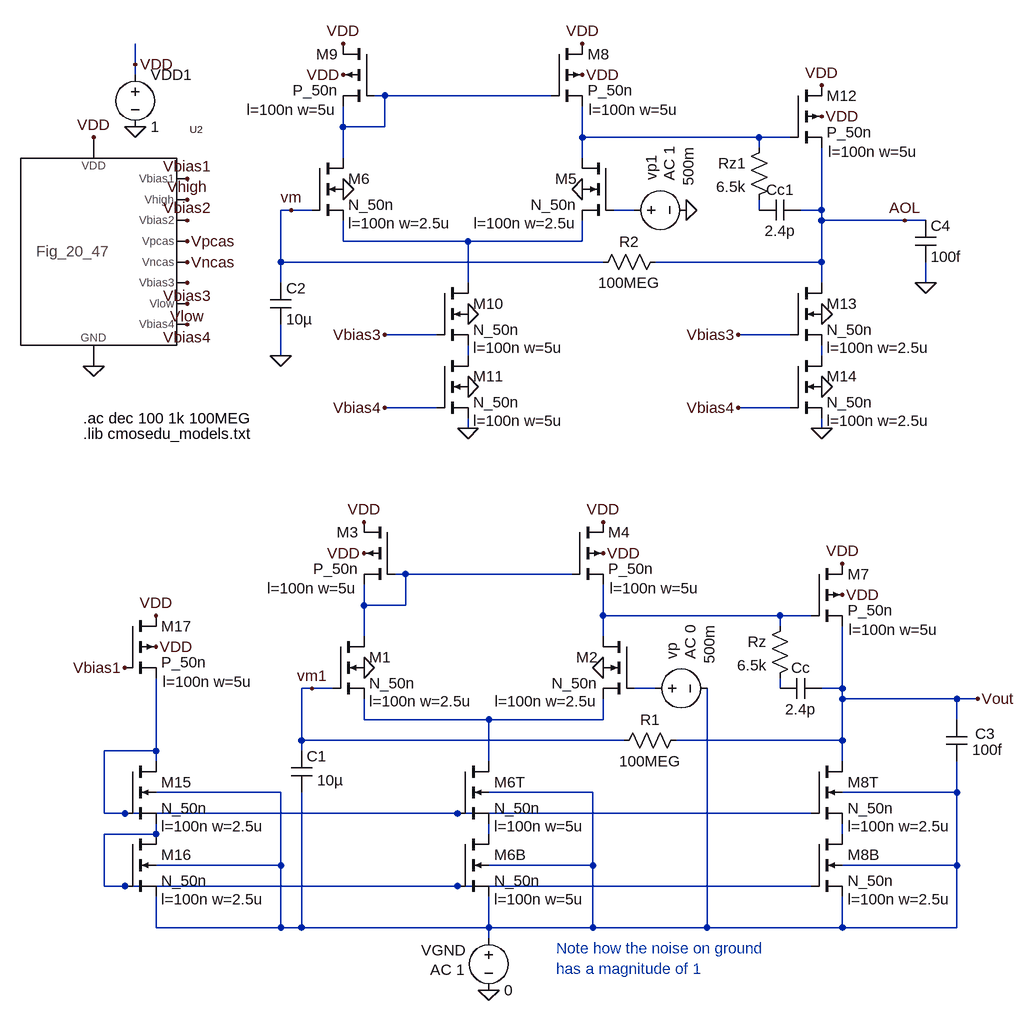
[diagram p0: schematic Fig24_27_PSRR_minus.asc]
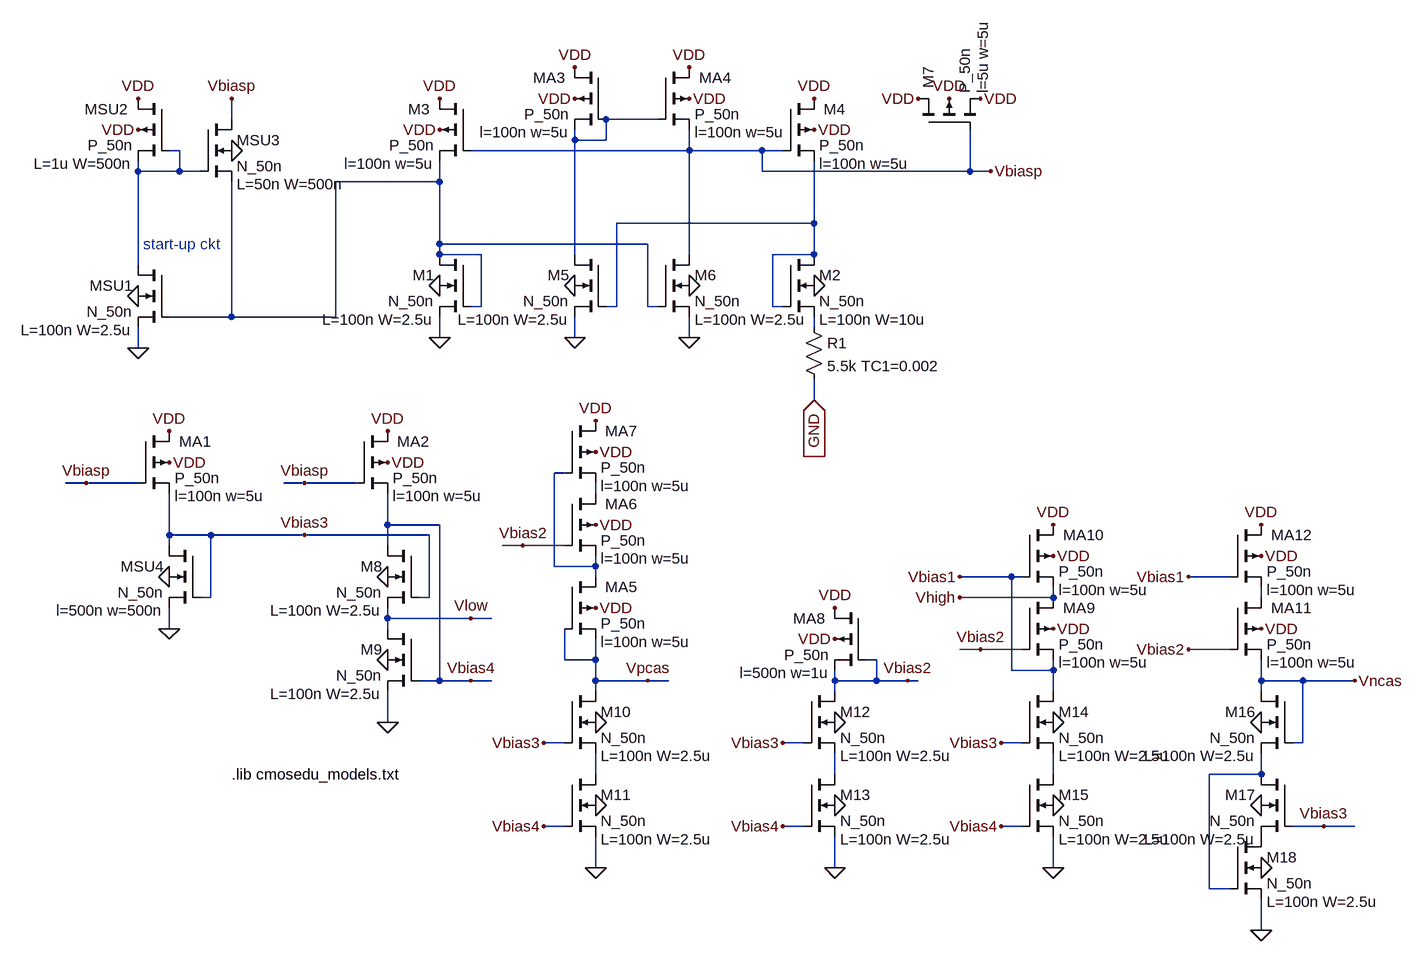
[diagram p1: sub-circuit fig_20_47.asc]
Fig24_27_PSRR_minus.asc, the LTspice schematic file:
Version 4
SHEET 1 2536 680
WIRE 848 -1536 848 -1568
WIRE 848 -1520 848 -1536
WIRE 1232 -1488 1216 -1488
WIRE 1488 -1488 1232 -1488
WIRE 1168 -1440 1168 -1472
WIRE 1232 -1440 1232 -1488
WIRE 1232 -1440 1168 -1440
WIRE 1536 -1424 1536 -1472
WIRE 1808 -1424 1536 -1424
WIRE 1856 -1424 1808 -1424
WIRE 1808 -1408 1808 -1424
WIRE 1168 -1392 1168 -1440
WIRE 1536 -1392 1536 -1424
WIRE 1088 -1312 1072 -1312
WIRE 1120 -1312 1088 -1312
WIRE 1616 -1312 1584 -1312
WIRE 1808 -1312 1808 -1328
WIRE 1904 -1312 1904 -1408
WIRE 1904 -1312 1872 -1312
WIRE 1904 -1296 1904 -1312
WIRE 2032 -1296 1904 -1296
WIRE 2064 -1296 2032 -1296
WIRE 1168 -1264 1168 -1296
WIRE 1360 -1264 1168 -1264
WIRE 1536 -1264 1536 -1296
WIRE 1536 -1264 1360 -1264
WIRE 1072 -1232 1072 -1312
WIRE 1568 -1232 1072 -1232
WIRE 1904 -1232 1904 -1296
WIRE 1904 -1232 1648 -1232
WIRE 1072 -1200 1072 -1232
WIRE 1360 -1200 1360 -1264
WIRE 1904 -1200 1904 -1232
WIRE 2064 -1200 2064 -1232
WIRE 1312 -1120 1232 -1120
WIRE 1856 -1120 1776 -1120
WIRE 1072 -1088 1072 -1136
WIRE 1360 -1088 1360 -1104
WIRE 1904 -1088 1904 -1104
WIRE 1312 -1008 1232 -1008
WIRE 1856 -1008 1776 -1008
WIRE 1360 -976 1360 -992
WIRE 1904 -976 1904 -992
WIRE 1264 -752 1248 -752
WIRE 1520 -752 1264 -752
WIRE 1200 -704 1200 -736
WIRE 1264 -704 1264 -752
WIRE 1264 -704 1200 -704
WIRE 1568 -688 1568 -736
WIRE 1840 -688 1568 -688
WIRE 1888 -688 1840 -688
WIRE 1840 -672 1840 -688
WIRE 1200 -656 1200 -704
WIRE 1568 -656 1568 -688
WIRE 1120 -576 1104 -576
WIRE 1152 -576 1120 -576
WIRE 1648 -576 1616 -576
WIRE 1840 -576 1840 -592
WIRE 1936 -576 1936 -672
WIRE 1936 -576 1904 -576
WIRE 1936 -560 1936 -576
WIRE 2112 -560 1936 -560
WIRE 2144 -560 2112 -560
WIRE 1200 -528 1200 -560
WIRE 1392 -528 1200 -528
WIRE 1568 -528 1568 -560
WIRE 1568 -528 1392 -528
WIRE 2112 -528 2112 -560
WIRE 1104 -496 1104 -576
WIRE 1600 -496 1104 -496
WIRE 1936 -496 1936 -560
WIRE 1936 -496 1680 -496
WIRE 880 -480 880 -592
WIRE 880 -480 800 -480
WIRE 1104 -480 1104 -496
WIRE 880 -464 880 -480
WIRE 1392 -464 1392 -528
WIRE 1936 -464 1936 -496
WIRE 1072 -416 880 -416
WIRE 1552 -416 1392 -416
WIRE 2112 -416 2112 -464
WIRE 2112 -416 1936 -416
WIRE 800 -384 800 -480
WIRE 832 -384 800 -384
WIRE 1344 -384 832 -384
WIRE 1888 -384 1344 -384
WIRE 880 -352 880 -368
WIRE 880 -352 800 -352
WIRE 1392 -352 1392 -368
WIRE 1936 -352 1936 -368
WIRE 1072 -304 1072 -416
WIRE 1072 -304 880 -304
WIRE 1552 -304 1552 -416
WIRE 1552 -304 1392 -304
WIRE 2112 -304 2112 -416
WIRE 2112 -304 1936 -304
WIRE 800 -272 800 -352
WIRE 832 -272 800 -272
WIRE 1344 -272 832 -272
WIRE 1888 -272 1344 -272
WIRE 880 -208 880 -256
WIRE 1072 -208 1072 -304
WIRE 1072 -208 880 -208
WIRE 1104 -208 1104 -416
WIRE 1104 -208 1072 -208
WIRE 1392 -208 1392 -256
WIRE 1392 -208 1104 -208
WIRE 1552 -208 1552 -304
WIRE 1552 -208 1392 -208
WIRE 1728 -208 1728 -576
WIRE 1728 -208 1552 -208
WIRE 1936 -208 1936 -256
WIRE 1936 -208 1728 -208
WIRE 2112 -208 2112 -304
WIRE 2112 -208 1936 -208
WIRE 1392 -192 1392 -208
FLAG 1568 -608 0
FLAG 1200 -608 0
FLAG 1568 -832 VDD
FLAG 1568 -784 VDD
FLAG 1200 -784 VDD
FLAG 1200 -832 VDD
FLAG 1120 -576 vm1
FLAG 1936 -768 VDD
FLAG 1936 -720 VDD
FLAG 2144 -560 Vout
FLAG 1392 -112 0
FLAG 848 -1440 0
FLAG 848 -1536 VDD
FLAG 1536 -1344 0
FLAG 1360 -976 0
FLAG 1168 -1344 0
FLAG 1536 -1568 VDD
FLAG 1536 -1520 VDD
FLAG 1168 -1520 VDD
FLAG 784 -1424 VDD
FLAG 784 -1072 0
FLAG 928 -1360 Vbias1
FLAG 928 -1328 Vhigh
FLAG 928 -1296 Vbias2
FLAG 928 -1200 Vbias3
FLAG 928 -1264 Vpcas
FLAG 928 -1232 Vncas
FLAG 928 -1136 Vbias4
FLAG 928 -1168 Vlow
FLAG 1168 -1568 VDD
FLAG 1360 -1152 0
FLAG 1360 -1040 0
FLAG 1232 -1120 Vbias3
FLAG 1232 -1008 Vbias4
FLAG 1696 -1312 0
FLAG 1088 -1312 vm
FLAG 1904 -1504 VDD
FLAG 1904 -1456 VDD
FLAG 1904 -976 0
FLAG 1904 -1152 0
FLAG 1904 -1040 0
FLAG 1776 -1120 Vbias3
FLAG 1776 -1008 Vbias4
FLAG 2032 -1296 AOL
FLAG 1072 -1088 0
FLAG 2064 -1200 0
FLAG 880 -688 VDD
FLAG 880 -640 VDD
FLAG 832 -608 Vbias1
SYMBOL nmos4 1616 -656 M0
WINDOW 123 56 100 Left 0
SYMATTR Value2 l=100n w=2.5u
SYMATTR InstName M2
SYMATTR Value N_50n
SYMBOL nmos4 1152 -656 R0
WINDOW 123 56 100 Left 0
SYMATTR Value2 l=100n w=2.5u
SYMATTR InstName M1
SYMATTR Value N_50n
SYMBOL pmos4 1520 -832 R0
WINDOW 123 58 102 Left 0
WINDOW 0 56 16 Left 0
SYMATTR Value2 l=100n w=5u
SYMATTR InstName M4
SYMATTR Value P_50n
SYMBOL pmos4 1248 -832 M0
WINDOW 123 58 102 Left 0
WINDOW 0 56 16 Left 0
SYMATTR Value2 l=100n w=5u
SYMATTR InstName M3
SYMATTR Value P_50n
SYMBOL nmos4 1344 -464 R0
WINDOW 123 56 100 Left 0
SYMATTR Value2 l=100n w=5u
SYMATTR InstName M6T
SYMATTR Value N_50n
SYMBOL nmos4 1344 -352 R0
WINDOW 123 56 100 Left 0
SYMATTR Value2 l=100n w=5u
SYMATTR InstName M6B
SYMATTR Value N_50n
SYMBOL voltage 1632 -576 R270
WINDOW 0 45 42 Left 0
WINDOW 3 37 99 Left 0
WINDOW 123 45 70 Left 0
WINDOW 39 0 0 Left 0
SYMATTR InstName vp
SYMATTR Value 500m
SYMATTR Value2 AC 0
SYMBOL pmos4 1888 -768 R0
WINDOW 123 58 102 Left 0
WINDOW 0 56 16 Left 0
SYMATTR Value2 l=100n w=5u
SYMATTR InstName M7
SYMATTR Value P_50n
SYMBOL nmos4 1888 -464 R0
WINDOW 123 56 100 Left 0
SYMATTR Value2 l=100n w=2.5u
SYMATTR InstName M8T
SYMATTR Value N_50n
SYMBOL nmos4 1888 -352 R0
WINDOW 123 56 100 Left 0
SYMATTR Value2 l=100n w=2.5u
SYMATTR InstName M8B
SYMATTR Value N_50n
SYMBOL cap 1088 -480 R0
WINDOW 3 40 45 Left 0
SYMATTR Value 10µ
SYMATTR InstName C1
SYMBOL res 1584 -480 R270
WINDOW 0 32 56 VTop 0
WINDOW 3 0 56 VBottom 0
SYMATTR InstName R1
SYMATTR Value 100MEG
SYMBOL cap 1904 -592 R90
WINDOW 0 0 32 VBottom 0
WINDOW 3 32 32 VTop 0
SYMATTR InstName Cc
SYMATTR Value 2.4p
SYMBOL cap 2096 -528 R0
WINDOW 0 44 22 Left 0
WINDOW 3 40 46 Left 0
SYMATTR InstName C3
SYMATTR Value 100f
SYMBOL res 1856 -688 M0
SYMATTR InstName Rz
SYMATTR Value 6.5k
SYMBOL voltage 1392 -208 R0
WINDOW 123 -90 65 Left 0
WINDOW 39 0 0 Left 0
WINDOW 0 -104 35 Left 0
SYMATTR Value2 AC 1
SYMATTR InstName VGND
SYMATTR Value 0
SYMBOL voltage 848 -1536 R0
WINDOW 123 0 0 Left 0
WINDOW 39 0 0 Left 0
SYMATTR InstName VDD1
SYMATTR Value 1
SYMBOL nmos4 1584 -1392 M0
WINDOW 123 56 100 Left 0
SYMATTR Value2 l=100n w=2.5u
SYMATTR InstName M5
SYMATTR Value N_50n
SYMBOL nmos4 1120 -1392 R0
WINDOW 123 56 100 Left 0
SYMATTR Value2 l=100n w=2.5u
SYMATTR InstName M6
SYMATTR Value N_50n
SYMBOL pmos4 1488 -1568 R0
WINDOW 123 58 102 Left 0
WINDOW 0 56 16 Left 0
SYMATTR Value2 l=100n w=5u
SYMATTR InstName M8
SYMATTR Value P_50n
SYMBOL pmos4 1216 -1568 M0
WINDOW 123 58 102 Left 0
WINDOW 0 56 16 Left 0
SYMATTR Value2 l=100n w=5u
SYMATTR InstName M9
SYMATTR Value P_50n
SYMBOL Fig_20_47 784 -1248 R0
SYMATTR InstName U2
SYMBOL nmos4 1312 -1200 R0
WINDOW 123 56 100 Left 0
SYMATTR Value2 l=100n w=5u
SYMATTR InstName M10
SYMATTR Value N_50n
SYMBOL nmos4 1312 -1088 R0
WINDOW 123 56 100 Left 0
SYMATTR Value2 l=100n w=5u
SYMATTR InstName M11
SYMATTR Value N_50n
SYMBOL voltage 1600 -1312 R270
WINDOW 0 45 42 Left 0
WINDOW 3 37 99 Left 0
WINDOW 123 45 70 Left 0
WINDOW 39 0 0 Left 0
SYMATTR InstName vp1
SYMATTR Value 500m
SYMATTR Value2 AC 1
SYMBOL pmos4 1856 -1504 R0
WINDOW 123 58 102 Left 0
WINDOW 0 56 16 Left 0
SYMATTR Value2 l=100n w=5u
SYMATTR InstName M12
SYMATTR Value P_50n
SYMBOL nmos4 1856 -1200 R0
WINDOW 123 56 100 Left 0
SYMATTR Value2 l=100n w=2.5u
SYMATTR InstName M13
SYMATTR Value N_50n
SYMBOL nmos4 1856 -1088 R0
WINDOW 123 56 100 Left 0
SYMATTR Value2 l=100n w=2.5u
SYMATTR InstName M14
SYMATTR Value N_50n
SYMBOL cap 1056 -1200 R0
SYMATTR InstName C2
SYMATTR Value 10µ
SYMBOL res 1552 -1216 R270
WINDOW 0 32 56 VTop 0
WINDOW 3 0 56 VBottom 0
SYMATTR InstName R2
SYMATTR Value 100MEG
SYMBOL cap 1872 -1328 R90
WINDOW 0 0 32 VBottom 0
WINDOW 3 32 32 VTop 0
SYMATTR InstName Cc1
SYMATTR Value 2.4p
SYMBOL cap 2048 -1296 R0
SYMATTR InstName C4
SYMATTR Value 100f
SYMBOL res 1824 -1424 M0
SYMATTR InstName Rz1
SYMATTR Value 6.5k
SYMBOL nmos4 832 -464 R0
WINDOW 123 56 100 Left 0
SYMATTR Value2 l=100n w=2.5u
SYMATTR InstName M15
SYMATTR Value N_50n
SYMBOL nmos4 832 -352 R0
WINDOW 123 56 100 Left 0
SYMATTR Value2 l=100n w=2.5u
SYMATTR InstName M16
SYMATTR Value N_50n
SYMBOL pmos4 832 -688 R0
WINDOW 123 58 102 Left 0
WINDOW 0 56 16 Left 0
SYMATTR Value2 l=100n w=5u
SYMATTR InstName M17
SYMATTR Value P_50n
TEXT 1496 -176 Left 0 ;Note how the noise on ground\nhas a magnitude of 1
TEXT 768 -968 Left 0 !.lib cmosedu_models.txt
TEXT 768 -992 Left 0 !.ac dec 100 1k 100MEG

fig_20_47.asc, the sub-circuit schematic file:
Version 4
SHEET 1 2508 1124
WIRE 464 416 432 416
WIRE 544 -64 544 -80
WIRE 544 80 544 -64
WIRE 544 208 544 176
WIRE 544 416 464 416
WIRE 592 496 592 432
WIRE 592 512 592 496
WIRE 592 640 592 608
WIRE 608 -96 592 -96
WIRE 608 -64 544 -64
WIRE 608 -64 608 -96
WIRE 640 -64 608 -64
WIRE 656 496 592 496
WIRE 656 592 640 592
WIRE 656 592 656 496
WIRE 688 -144 688 -176
WIRE 688 160 592 160
WIRE 688 160 688 -48
WIRE 800 416 768 416
WIRE 800 496 656 496
WIRE 848 160 688 160
WIRE 848 160 848 -48
WIRE 880 416 800 416
WIRE 928 480 928 432
WIRE 928 512 928 480
WIRE 928 624 928 608
WIRE 928 640 928 624
WIRE 928 784 928 736
WIRE 992 496 800 496
WIRE 992 592 976 592
WIRE 992 592 992 496
WIRE 1008 -48 848 -48
WIRE 1008 -48 1008 -80
WIRE 1008 48 1008 -48
WIRE 1008 64 1008 48
WIRE 1008 192 1008 160
WIRE 1008 480 928 480
WIRE 1008 720 976 720
WIRE 1008 720 1008 480
WIRE 1056 624 928 624
WIRE 1056 720 1008 720
WIRE 1072 64 1008 64
WIRE 1072 144 1056 144
WIRE 1072 144 1072 64
WIRE 1088 624 1056 624
WIRE 1088 720 1056 720
WIRE 1136 512 1104 512
WIRE 1184 544 1184 400
WIRE 1200 400 1184 400
WIRE 1200 512 1136 512
WIRE 1200 688 1200 640
WIRE 1200 816 1168 816
WIRE 1200 944 1168 944
WIRE 1216 -112 1216 -128
WIRE 1216 64 1216 -112
WIRE 1216 192 1216 160
WIRE 1248 432 1248 416
WIRE 1248 544 1184 544
WIRE 1248 544 1248 528
WIRE 1248 560 1248 544
WIRE 1248 688 1200 688
WIRE 1248 688 1248 656
WIRE 1248 720 1248 688
WIRE 1248 736 1248 720
WIRE 1248 864 1248 832
WIRE 1248 1008 1248 960
WIRE 1264 -112 1216 -112
WIRE 1264 -112 1264 -144
WIRE 1280 144 1264 144
WIRE 1280 144 1280 16
WIRE 1328 48 1008 48
WIRE 1328 144 1328 48
WIRE 1328 720 1248 720
WIRE 1344 -144 1264 -144
WIRE 1344 144 1328 144
WIRE 1360 720 1328 720
WIRE 1392 -96 1056 -96
WIRE 1392 -96 1392 -128
WIRE 1392 64 1392 -96
WIRE 1392 192 1392 160
WIRE 1504 -96 1392 -96
WIRE 1504 -64 1504 -96
WIRE 1520 144 1520 64
WIRE 1536 -96 1504 -96
WIRE 1536 144 1520 144
WIRE 1568 816 1536 816
WIRE 1568 944 1536 944
WIRE 1584 16 1280 16
WIRE 1584 16 1584 -80
WIRE 1584 64 1520 64
WIRE 1584 64 1584 16
WIRE 1584 176 1584 160
WIRE 1584 288 1584 256
WIRE 1616 720 1616 704
WIRE 1616 736 1616 720
WIRE 1616 864 1616 832
WIRE 1616 1008 1616 960
WIRE 1680 688 1664 688
WIRE 1680 720 1616 720
WIRE 1680 720 1680 688
WIRE 1728 720 1680 720
WIRE 1744 720 1728 720
WIRE 1824 -64 1504 -64
WIRE 1824 -64 1824 -128
WIRE 1840 672 1808 672
WIRE 1856 -64 1824 -64
WIRE 1888 560 1808 560
WIRE 1888 704 1888 560
WIRE 1904 560 1888 560
WIRE 1904 672 1840 672
WIRE 1904 816 1872 816
WIRE 1904 944 1872 944
WIRE 1952 592 1808 592
WIRE 1952 592 1952 576
WIRE 1952 704 1888 704
WIRE 1952 704 1952 688
WIRE 1952 736 1952 704
WIRE 1952 864 1952 832
WIRE 1952 1008 1952 960
WIRE 2192 1040 2192 864
WIRE 2224 560 2160 560
WIRE 2224 672 2160 672
WIRE 2224 1040 2192 1040
WIRE 2272 592 2272 576
WIRE 2272 720 2272 688
WIRE 2272 736 2272 720
WIRE 2272 864 2192 864
WIRE 2272 864 2272 832
WIRE 2272 880 2272 864
WIRE 2272 1104 2272 1056
WIRE 2336 720 2272 720
WIRE 2336 816 2320 816
WIRE 2336 816 2336 720
WIRE 2368 944 2320 944
WIRE 2416 720 2336 720
WIRE 2416 944 2368 944
FLAG 544 -128 VDD
FLAG 544 -176 VDD
FLAG 544 208 0
FLAG 544 128 0
FLAG 688 -96 0
FLAG 688 -176 Vbiasp
FLAG 1008 -128 VDD
FLAG 1008 -176 VDD
FLAG 1584 -128 VDD
FLAG 1584 -176 VDD
FLAG 1856 -64 Vbiasp
FLAG 1008 192 0
FLAG 1008 112 0
FLAG 1584 112 0
FLAG 1392 -176 VDD
FLAG 1392 -224 VDD
FLAG 1216 -176 VDD
FLAG 1216 -224 VDD
FLAG 1216 112 0
FLAG 1392 112 0
FLAG 1216 192 0
FLAG 1392 192 0
FLAG 1792 -176 VDD
FLAG 1744 -176 VDD
FLAG 1840 -176 VDD
FLAG 592 384 VDD
FLAG 592 336 VDD
FLAG 464 416 Vbiasp
FLAG 928 384 VDD
FLAG 928 336 VDD
FLAG 800 416 Vbiasp
FLAG 592 640 0
FLAG 592 560 0
FLAG 928 560 0
FLAG 928 688 0
FLAG 928 784 0
FLAG 800 496 Vbias3
FLAG 1248 784 0
FLAG 1248 912 0
FLAG 1248 1008 0
FLAG 1056 624 Vlow
FLAG 1056 720 Vbias4
FLAG 1168 816 Vbias3
FLAG 1168 944 Vbias4
FLAG 1616 784 0
FLAG 1616 912 0
FLAG 1616 1008 0
FLAG 1536 816 Vbias3
FLAG 1536 944 Vbias4
FLAG 1952 784 0
FLAG 1952 912 0
FLAG 1952 1008 0
FLAG 1872 816 Vbias3
FLAG 1872 944 Vbias4
FLAG 1248 608 VDD
FLAG 1328 720 Vpcas
FLAG 1248 480 VDD
FLAG 1248 368 VDD
FLAG 1248 320 VDD
FLAG 1136 512 Vbias2
FLAG 1616 656 VDD
FLAG 1616 608 VDD
FLAG 1728 720 Vbias2
FLAG 1952 640 VDD
FLAG 1952 528 VDD
FLAG 1952 480 VDD
FLAG 1840 672 Vbias2
FLAG 1808 560 Vbias1
FLAG 1808 592 Vhigh
FLAG 2272 640 VDD
FLAG 2272 528 VDD
FLAG 2272 480 VDD
FLAG 2160 560 Vbias1
FLAG 2160 672 Vbias2
FLAG 2272 784 0
FLAG 2272 912 0
FLAG 2272 1008 0
FLAG 2272 1104 0
FLAG 2416 720 Vncas
FLAG 2368 944 Vbias3
FLAG 1584 288 GND
IOPIN 1584 288 In
SYMBOL pmos4 592 -176 M0
WINDOW 0 63 16 Left 0
WINDOW 123 56 100 Left 0
SYMATTR InstName MSU2
SYMATTR Value2 L=1u W=500n
SYMATTR Value P_50n
SYMBOL nmos4 592 80 M0
WINDOW 123 56 100 Left 0
SYMATTR Value2 L=100n W=2.5u
SYMATTR InstName MSU1
SYMATTR Value N_50n
SYMBOL nmos4 640 -144 R0
WINDOW 123 56 100 Left 0
SYMATTR Value2 L=50n W=500n
SYMATTR InstName MSU3
SYMATTR Value N_50n
SYMBOL pmos4 1056 -176 M0
WINDOW 0 63 16 Left 0
WINDOW 123 56 100 Left 0
SYMATTR InstName M3
SYMATTR Value2 l=100n w=5u
SYMATTR Value P_50n
SYMBOL pmos4 1536 -176 R0
WINDOW 0 63 16 Left 0
WINDOW 123 56 100 Left 0
SYMATTR InstName M4
SYMATTR Value2 l=100n w=5u
SYMATTR Value P_50n
SYMBOL nmos4 1056 64 M0
WINDOW 123 56 100 Left 0
SYMATTR Value2 L=100n W=2.5u
SYMATTR InstName M1
SYMATTR Value N_50n
SYMBOL nmos4 1536 64 R0
WINDOW 123 56 100 Left 0
SYMATTR Value2 L=100n W=10u
SYMATTR InstName M2
SYMATTR Value N_50n
SYMBOL res 1568 160 R0
SYMATTR InstName R1
SYMATTR Value 5.5k TC1=0.002
SYMBOL pmos4 1344 -224 R0
WINDOW 0 63 16 Left 0
WINDOW 123 56 100 Left 0
SYMATTR InstName MA4
SYMATTR Value2 l=100n w=5u
SYMATTR Value P_50n
SYMBOL pmos4 1264 -224 M0
WINDOW 0 63 16 Left 0
WINDOW 123 56 100 Left 0
SYMATTR InstName MA3
SYMATTR Value2 l=100n w=5u
SYMATTR Value P_50n
SYMBOL nmos4 1264 64 M0
WINDOW 123 56 100 Left 0
SYMATTR Value2 L=100n W=2.5u
SYMATTR InstName M5
SYMATTR Value N_50n
SYMBOL nmos4 1344 64 R0
WINDOW 123 56 100 Left 0
SYMATTR Value2 L=100n W=2.5u
SYMATTR InstName M6
SYMATTR Value N_50n
SYMBOL pmos4 1744 -128 R270
WINDOW 0 63 16 Left 0
WINDOW 123 56 100 Left 0
SYMATTR InstName M7
SYMATTR Value2 l=5u w=5u
SYMATTR Value P_50n
SYMBOL pmos4 544 336 R0
WINDOW 0 63 16 Left 0
WINDOW 123 56 100 Left 0
SYMATTR InstName MA1
SYMATTR Value2 l=100n w=5u
SYMATTR Value P_50n
SYMBOL pmos4 880 336 R0
WINDOW 0 63 16 Left 0
WINDOW 123 56 100 Left 0
SYMATTR InstName MA2
SYMATTR Value2 l=100n w=5u
SYMATTR Value P_50n
SYMBOL nmos4 640 512 M0
WINDOW 123 56 100 Left 0
SYMATTR Value2 l=500n w=500n
SYMATTR InstName MSU4
SYMATTR Value N_50n
SYMBOL nmos4 976 512 M0
WINDOW 123 56 100 Left 0
SYMATTR Value2 L=100n W=2.5u
SYMATTR InstName M8
SYMATTR Value N_50n
SYMBOL nmos4 976 640 M0
WINDOW 123 56 100 Left 0
SYMATTR Value2 L=100n W=2.5u
SYMATTR InstName M9
SYMATTR Value N_50n
SYMBOL nmos4 1200 736 R0
WINDOW 123 56 100 Left 0
SYMATTR Value2 L=100n W=2.5u
SYMATTR InstName M10
SYMATTR Value N_50n
SYMBOL nmos4 1200 864 R0
WINDOW 123 56 100 Left 0
SYMATTR Value2 L=100n W=2.5u
SYMATTR InstName M11
SYMATTR Value N_50n
SYMBOL nmos4 1568 736 R0
WINDOW 123 56 100 Left 0
SYMATTR Value2 L=100n W=2.5u
SYMATTR InstName M12
SYMATTR Value N_50n
SYMBOL nmos4 1568 864 R0
WINDOW 123 56 100 Left 0
SYMATTR Value2 L=100n W=2.5u
SYMATTR InstName M13
SYMATTR Value N_50n
SYMBOL nmos4 1904 736 R0
WINDOW 123 56 100 Left 0
SYMATTR Value2 L=100n W=2.5u
SYMATTR InstName M14
SYMATTR Value N_50n
SYMBOL nmos4 1904 864 R0
WINDOW 123 56 100 Left 0
SYMATTR Value2 L=100n W=2.5u
SYMATTR InstName M15
SYMATTR Value N_50n
SYMBOL pmos4 1200 560 R0
WINDOW 0 63 16 Left 0
WINDOW 123 56 100 Left 0
SYMATTR InstName MA5
SYMATTR Value2 l=100n w=5u
SYMATTR Value P_50n
SYMBOL pmos4 1200 432 R0
WINDOW 0 63 16 Left 0
WINDOW 123 56 100 Left 0
SYMATTR InstName MA6
SYMATTR Value2 l=100n w=5u
SYMATTR Value P_50n
SYMBOL pmos4 1200 320 R0
WINDOW 0 63 16 Left 0
WINDOW 123 56 100 Left 0
SYMATTR InstName MA7
SYMATTR Value2 l=100n w=5u
SYMATTR Value P_50n
SYMBOL pmos4 1664 608 M0
WINDOW 0 63 16 Left 0
WINDOW 123 56 100 Left 0
SYMATTR InstName MA8
SYMATTR Value2 l=500n w=1u
SYMATTR Value P_50n
SYMBOL pmos4 1904 592 R0
WINDOW 0 63 16 Left 0
WINDOW 123 56 100 Left 0
SYMATTR InstName MA9
SYMATTR Value2 l=100n w=5u
SYMATTR Value P_50n
SYMBOL pmos4 1904 480 R0
WINDOW 0 63 16 Left 0
WINDOW 123 56 100 Left 0
SYMATTR InstName MA10
SYMATTR Value2 l=100n w=5u
SYMATTR Value P_50n
SYMBOL pmos4 2224 592 R0
WINDOW 0 63 16 Left 0
WINDOW 123 56 100 Left 0
SYMATTR InstName MA11
SYMATTR Value2 l=100n w=5u
SYMATTR Value P_50n
SYMBOL pmos4 2224 480 R0
WINDOW 0 63 16 Left 0
WINDOW 123 56 100 Left 0
SYMATTR InstName MA12
SYMATTR Value2 l=100n w=5u
SYMATTR Value P_50n
SYMBOL nmos4 2320 736 M0
WINDOW 123 56 100 Left 0
SYMATTR Value2 L=100n W=2.5u
SYMATTR InstName M16
SYMATTR Value N_50n
SYMBOL nmos4 2320 864 M0
WINDOW 123 56 100 Left 0
SYMATTR Value2 L=100n W=2.5u
SYMATTR InstName M17
SYMATTR Value N_50n
SYMBOL nmos4 2224 960 R0
WINDOW 123 56 100 Left 0
SYMATTR Value2 L=100n W=2.5u
SYMATTR InstName M18
SYMATTR Value N_50n
TEXT 552 48 Left 0 ;start-up ckt
TEXT 688 864 Left 0 !.lib cmosedu_models.txt

The netlist it stands for:
* Fig24_27_PSRR_minus.asc
M2 N009 N010 N012 0 N_50n l=100n w=2.5u
M1 N008 vm1 N012 0 N_50n l=100n w=2.5u
M4 VDD N008 N009 VDD P_50n l=100n w=5u
M3 VDD N008 N008 VDD P_50n l=100n w=5u
M6T N012 N013 N016 N014 N_50n l=100n w=5u
M6B N016 N015 N014 N014 N_50n l=100n w=5u
vp N010 N014 500m AC 0
M7 VDD N009 Vout VDD P_50n l=100n w=5u
M8T Vout N013 N017 N014 N_50n l=100n w=2.5u
M8B N017 N015 N014 N014 N_50n l=100n w=2.5u
C1 vm1 N014 10µ
R1 vm1 Vout 100MEG
Cc Vout N011 2.4p
C3 Vout N014 100f
Rz N009 N011 6.5k
VGND N014 0 0 AC 1
VDD1 VDD 0 1
M5 N002 N003 N005 0 N_50n l=100n w=2.5u
M6 N001 vm N005 0 N_50n l=100n w=2.5u
M8 VDD N001 N002 VDD P_50n l=100n w=5u
M9 VDD N001 N001 VDD P_50n l=100n w=5u
XU2 Vbias1 Vhigh Vbias2 Vpcas Vncas Vbias3 Vlow Vbias4 VDD 0 fig_20_47
M10 N005 Vbias3 N006 0 N_50n l=100n w=5u
M11 N006 Vbias4 0 0 N_50n l=100n w=5u
vp1 N003 0 500m AC 1
M12 VDD N002 AOL VDD P_50n l=100n w=5u
M13 AOL Vbias3 N007 0 N_50n l=100n w=2.5u
M14 N007 Vbias4 0 0 N_50n l=100n w=2.5u
C2 vm 0 10µ
R2 vm AOL 100MEG
Cc1 AOL N004 2.4p
C4 AOL 0 100f
Rz1 N002 N004 6.5k
M15 N013 N013 N015 N014 N_50n l=100n w=2.5u
M16 N015 N015 N014 N014 N_50n l=100n w=2.5u
M17 VDD Vbias1 N013 VDD P_50n l=100n w=5u

* block symbol definitions
.subckt fig_20_47 Vbias1 Vhigh Vbias2 Vpcas Vncas Vbias3 Vlow Vbias4 VDD GND
MSU2 VDD N001 N001 VDD P_50n L=1u W=500n
MSU1 N001 N002 0 0 N_50n L=100n W=2.5u
MSU3 Vbiasp N001 N002 0 N_50n L=50n W=500n
M3 VDD Vbiasp N002 VDD P_50n l=100n w=5u
M4 VDD Vbiasp N007 VDD P_50n l=100n w=5u
M1 N002 N002 0 0 N_50n L=100n W=2.5u
M2 N007 N007 N008 0 N_50n L=100n W=10u
R1 N008 GND 5.5k TC1=0.002
MA4 VDD N004 Vbiasp VDD P_50n l=100n w=5u
MA3 VDD N004 N004 VDD P_50n l=100n w=5u
M5 N004 N007 0 0 N_50n L=100n W=2.5u
M6 Vbiasp N002 0 0 N_50n L=100n W=2.5u
M7 VDD Vbiasp VDD VDD P_50n l=5u w=5u
MA1 VDD Vbiasp Vbias3 VDD P_50n l=100n w=5u
MA2 VDD Vbiasp Vbias4 VDD P_50n l=100n w=5u
MSU4 Vbias3 Vbias3 0 0 N_50n l=500n w=500n
M8 Vbias4 Vbias3 Vlow 0 N_50n L=100n W=2.5u
M9 Vlow Vbias4 0 0 N_50n L=100n W=2.5u
M10 Vpcas Vbias3 N006 0 N_50n L=100n W=2.5u
M11 N006 Vbias4 0 0 N_50n L=100n W=2.5u
M12 Vbias2 Vbias3 N009 0 N_50n L=100n W=2.5u
M13 N009 Vbias4 0 0 N_50n L=100n W=2.5u
M14 Vbias1 Vbias3 N010 0 N_50n L=100n W=2.5u
M15 N010 Vbias4 0 0 N_50n L=100n W=2.5u
MA5 N003 Vpcas Vpcas VDD P_50n l=100n w=5u
MA6 N005 Vbias2 N003 VDD P_50n l=100n w=5u
MA7 VDD N003 N005 VDD P_50n l=100n w=5u
MA8 VDD Vbias2 Vbias2 VDD P_50n l=500n w=1u
MA9 Vhigh Vbias2 Vbias1 VDD P_50n l=100n w=5u
MA10 VDD Vbias1 Vhigh VDD P_50n l=100n w=5u
MA11 N012 Vbias2 Vncas VDD P_50n l=100n w=5u
MA12 VDD Vbias1 N012 VDD P_50n l=100n w=5u
M16 Vncas Vncas N011 0 N_50n L=100n W=2.5u
M17 N011 Vbias3 P001 0 N_50n L=100n W=2.5u
M18 P001 N011 0 0 N_50n L=100n W=2.5u
* start-up ckt
.lib cmosedu_models.txt
.ends fig_20_47

.model NMOS NMOS
.model PMOS PMOS
.lib standard.mos
* Note how the noise on ground
* has a magnitude of 1
.lib cmosedu_models.txt
.ac dec 100 1k 100MEG
.backanno
.end